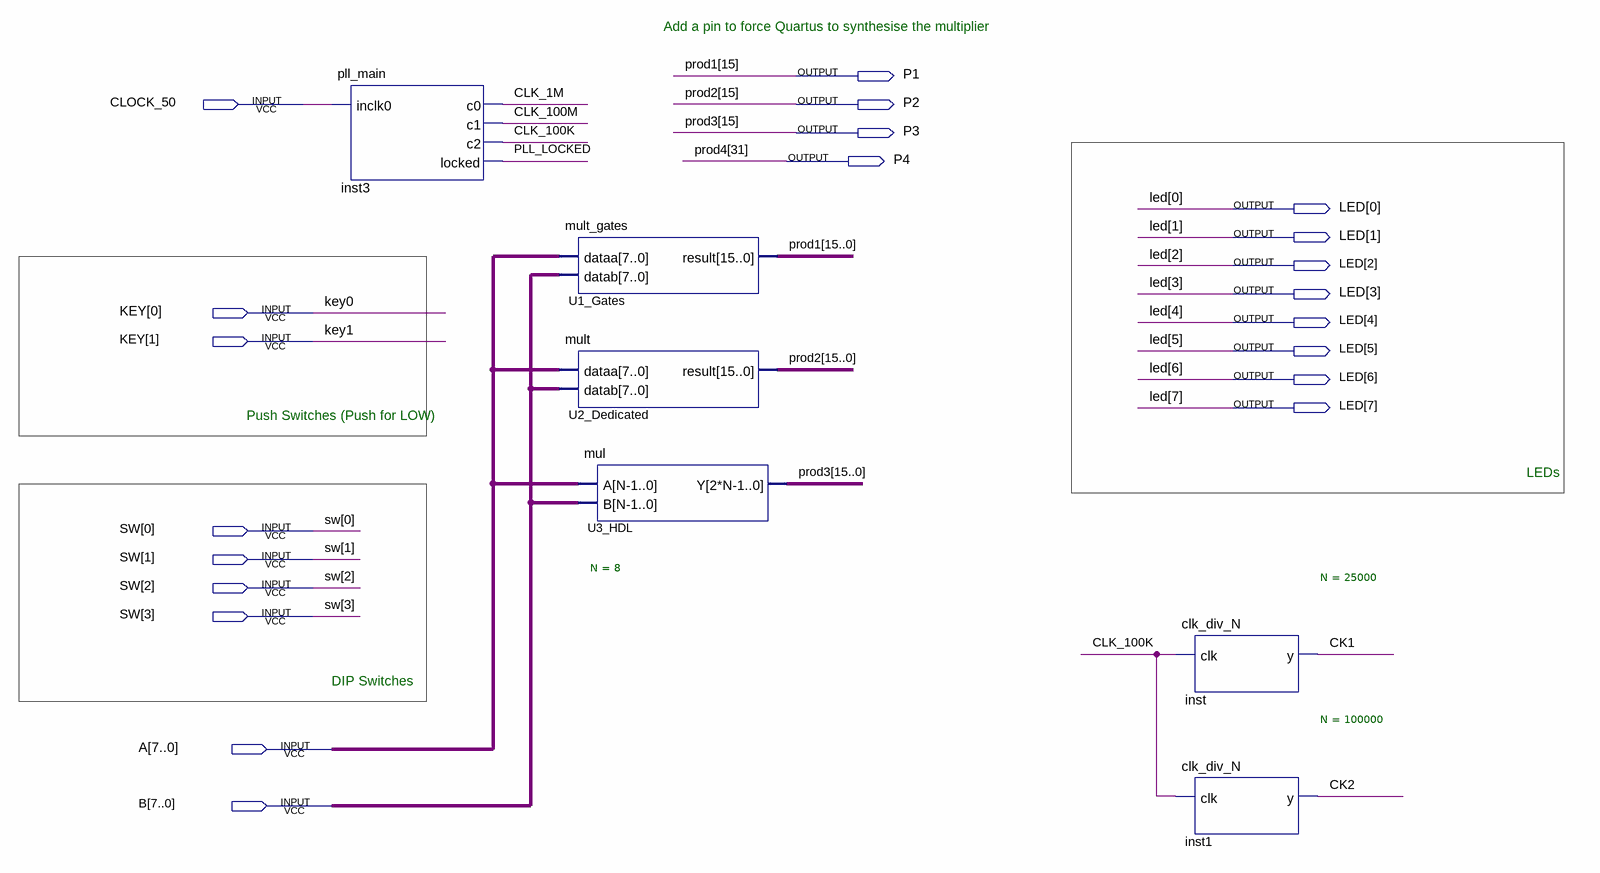
[diagram p0: schematic sheet]
// Quartus schematic TopLevelSchematic.bdf as structural Verilog: 6 symbols, 21 pins
module TopLevelSchematic (
  input  CLOCK_50,
  input  [1:0] KEY,
  input  [3:0] SW,
  input  [7:0] A,
  input  [7:0] B,
  output P1,
  output P2,
  output P3,
  output P4,
  output [7:0] LED
);

  wire CK1, CK2, CLK_1M, CLK_100K, CLK_100M, PLL_LOCKED;
  wire [14:0] prod1, prod2, prod3;

  pll_main inst3 (.inclk0(CLOCK_50), .c0(CLK_1M), .c1(CLK_100M), .c2(CLK_100K), .locked(PLL_LOCKED));
  mult_gates U1_Gates (.dataa(A), .datab(B), .result({P1, prod1}));
  mult U2_Dedicated (.dataa(A), .datab(B), .result({P2, prod2}));
  mul #(.N(8)) U3_HDL (.A(A), .B(B), .Y({P3, prod3}));
  clk_div_N #(.N(25000)) inst (.clk(CLK_100K), .y(CK1));
  clk_div_N #(.N(100000)) inst1 (.clk(CLK_100K), .y(CK2));

  // Other names for the same wires on the sheet: prod1[15] = P1; prod2[15] = P2; prod3[15] = P3; prod4[31] = P4

  // Notes on the sheet:
  //   Add a pin to force Quartus to synthesise the multiplier
  //   Push Switches (Push for LOW)
  //   LEDs
  //   DIP Switches
endmodule
